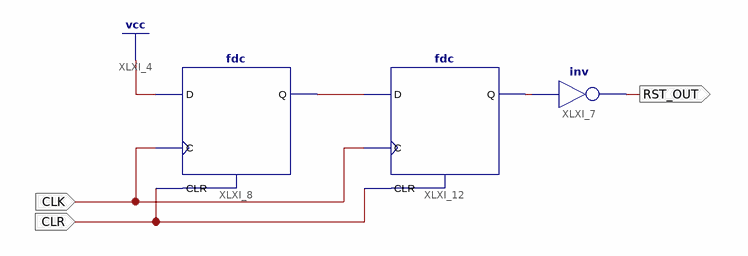
[diagram p0: schematic sheet 1]
// Xilinx ISE schematic SyncReset.sch (xc9500xl) as structural Verilog: 3 symbols, 3 ports
module SyncReset (
  input  CLR,
  input  CLK,
  output RST_OUT
);

  wire XLXN_21, XLXN_26;

  fdc XLXI_8 (.C(CLK), .CLR(CLR), .D(1'b1), .Q(XLXN_21));
  fdc XLXI_12 (.C(CLK), .CLR(CLR), .D(XLXN_21), .Q(XLXN_26));
  not XLXI_7 (RST_OUT, XLXN_26);
endmodule
